# Altium schematic sheet medusa-charger.SchDoc
size Legal; SheetNumber: 5; SheetTotal: 5
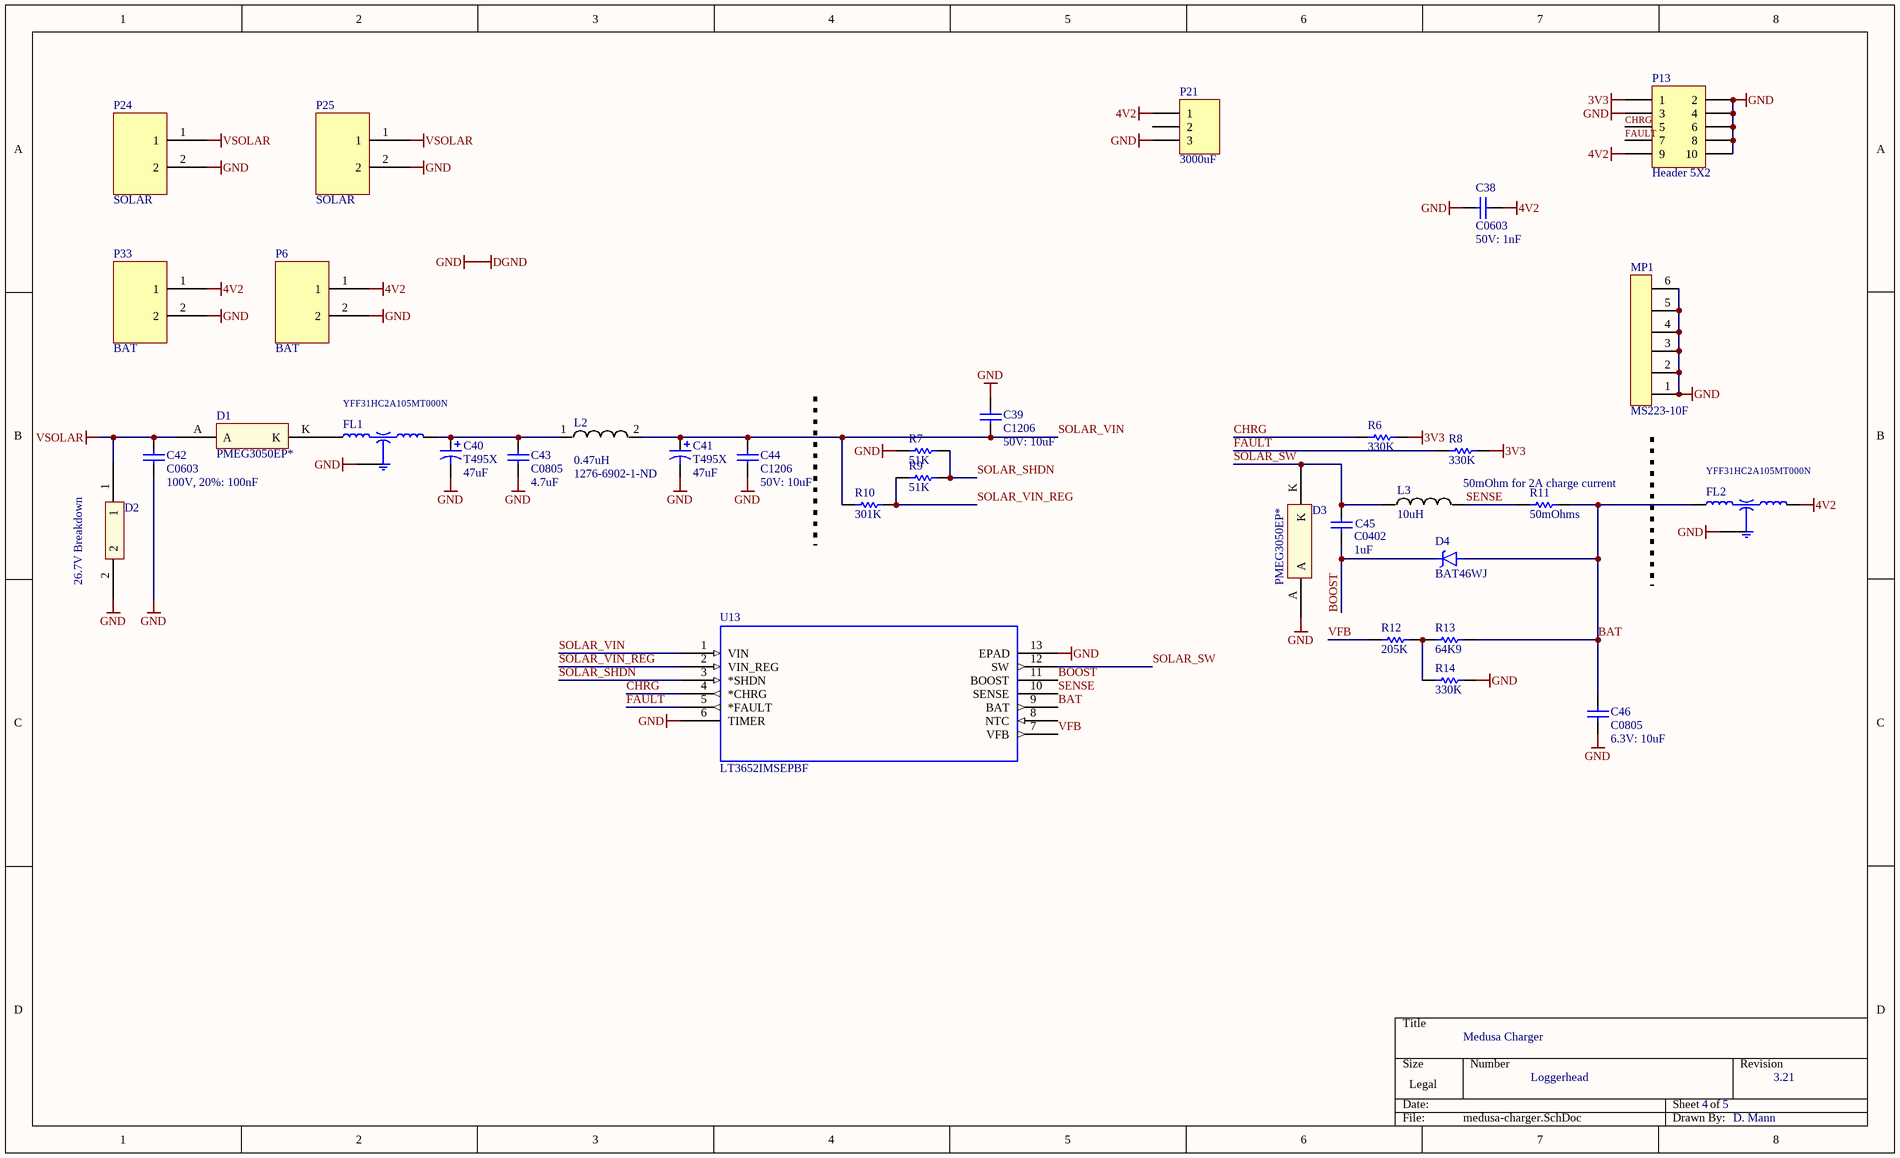
[diagram p0: medusa-charger.SchDoc]

## Parts
C38  C0603  50V: 1nF  [0603]
C39  C1206  50V: 10uF  [1206]
C40  T495X  value 47uF  [X]
C41  T495X  value 47uF  [X]
C42  C0603  100V, 20%: 100nF  [0603]
C43  C0805  value 4.7uF  [0805]
C44  C1206  50V: 10uF  [1206]
C45  C0402  value 1uF  [0402]
C46  C0805  6.3V: 10uF  [0805]
D1  PMEG3050EP*  [Diode_PMEG3050EP]
D2  26.7V Breakdown  [SMBJ24CA]
D3  PMEG3050EP*  [Diode_PMEG3050EP]
D4  BAT46WJ  [SOD-323]
FL1  YFF31HC2A105MT000N  [FIL_YFF31HC2A105MT000N]
FL2  YFF31HC2A105MT000N  [FIL_YFF31HC2A105MT000N]
L2  value 0.47uH  Supplier Part Number 1: 1276-6902-1-ND  [Inductor2016]  (hidden comment: Inductor2016)
L3  10uH  [Inductor0630CDMCD]
MP1  MS223-10F  [MS223-10F]
P6  BAT  [HDR_2x1_2mm]
P13  Header 5X2  [HDR2X5]
P21  3000uF  [HDR1X3]
P24  SOLAR  [HDR_2x1_2mm]
P25  SOLAR  [HDR_2x1_2mm]
P33  BAT  [HDR_2x1_2mm]
R6  330K  [3-0603]
R7  51K  [3-0603]
R8  330K  [3-0603]
R9  51K  [3-0603]
R10  301K  [3-0603]
R11  50mOhms  [8-1206]
R12  205K  [3-0603]
R13  64K9  [3-0603]
R14  330K  [3-0603]
U13  LT3652IMSEPBF  [MSOP-12_MSE]

## Nets
3V3: P13.1 R6.1 R8.1
4V2: C38.2 FL2.3(OUT/IN) P6.1 P13.9 P21.1 P33.1
DGND: C38.1 C39.1 C40.2 C41.2 C42.1 C43.1 C44.1 C46.1 D2.2 D3.A FL1.2_4(GND) FL2.2_4(GND) MP1.1 MP1.2 MP1.3 MP1.4 MP1.5 MP1.6 P6.2 P13.2 P13.3 P13.4 P13.6 P13.8 P13.10 P21.3 P24.2 P25.2 P33.2 R7.1 R14.1 U13.6(TIMER) U13.13(EPAD)  [also labelled GND]
VSOLAR: C42.2 D1.A D2.1 P24.1 P25.1
BAT: C46.2 D4.A FL2.1(IN/OUT) R11.2 R13.1 U13.9(BAT)
BOOST: C45.1 D4.C U13.11(BOOST)
CHRG: P13.5 R6.2 U13.4(*CHRG)
FAULT: P13.7 R8.2 U13.5(*FAULT)
SENSE: L3.2 R11.1 U13.10(SENSE)
SOLAR_SHDN: R7.2 R9.2 U13.3(*SHDN)
SOLAR_SW: C45.2 D3.K L3.1 U13.12(SW)
SOLAR_VIN: C39.2 C41.1 C44.2 L2.2 R10.1 U13.1(VIN)
SOLAR_VIN_REG: R9.1 R10.2 U13.2(VIN_REG)
VFB: R12.2 U13.7(VFB)
NetC40_1: C40.1 C43.2 FL1.3(OUT/IN) L2.1
NetD1_K: D1.K FL1.1(IN/OUT)
NetR12_1: R12.1 R13.2 R14.2

Not connected (* = marked no-connect by the designer): P21 2; U13 8(NTC)

## Notes on the sheet
- 50mOhm for 2A charge current
- Medusa Charger
- Loggerhead
- 4
- 5
- 3.21
- D. Mann

## Library data of the parts
C38 = C0603: Ceramic Chip Capacitor - Standard; Note: Footprint corresponds to dimensions for bulk cassette packaging. This case size has tightened tolerances.; Published: 17-Jul-2002; LatestRevisionDate: 19-Mar-2004; LatestRevisionNote: Silkscreen size reduced.; DatasheetDocument: Mar-2001; PackageDocument: Mar-2001; PackageReference: 0603; Publisher: Altium Limited; Code_JEITA: 0603; Code_IPC: 1608 [0603]; ComponentLink1Description: Manufacturer Link; ComponentLink1URL: http://www.kemet.com/; ComponentLink2Description: Datasheet; ComponentLink2URL: http://www.kemet.com/kemet/web/homepage/kechome.nsf/vapubfilesname/F3102TA.pdf/$file/F3102TA.pdf
C39 C44 = C1206: Ceramic Chip Capacitor - Standard; Published: 17-Jul-2002; LatestRevisionDate: 19-Mar-2004; LatestRevisionNote: Silkscreen size reduced.; DatasheetDocument: Mar-2001; PackageDocument: Mar-2001; PackageReference: 1206; Publisher: Altium Limited; Code_JEITA: 1206; Code_IPC: 3216 [1206]; ComponentLink1Description: Manufacturer Link; ComponentLink1URL: http://www.kemet.com/; ComponentLink2Description: Datasheet; ComponentLink2URL: http://www.kemet.com/kemet/web/homepage/kechome.nsf/vapubfilesname/F3102TA.pdf/$file/F3102TA.pdf
C40 C41 = T495X: Solid Tantalum Chip Capacitor, Standard T495 Series - 35V 10%; PCB_Layout: Round Glue Pad at 2.9 ±0.1mm in diameter at KEMET's option; Published: 17-Jul-2002; LatestRevisionDate: 19-Mar-2004; LatestRevisionNote: Silkscreen dimensions re-sized.; DatasheetDocument: Mar-2001; PackageDocument: Mar-2001; PackageReference: X; Publisher: Altium Limited; Code_JEITA: 7343-43; ComponentLink1Description: Manufacturer Link; ComponentLink1URL: http://www.kemet.com/; ComponentLink2Description: Datasheet; ComponentLink2URL: http://www.kemet.com/kemet/web/homepage/kechome.nsf/vapubfilesname/F3102TA.pdf/$file/F3102TA.pdf
C42 = C0603: 100V 20%; Note: Footprint corresponds to dimensions for bulk cassette packaging. This case size has tightened tolerances.; Published: 17-Jul-2002; LatestRevisionDate: 19-Mar-2004; LatestRevisionNote: Silkscreen size reduced.; DatasheetDocument: Mar-2001; PackageDocument: Mar-2001; PackageReference: 0603; Publisher: Altium Limited; Code_JEITA: 0603; Code_IPC: 1608 [0603]; ComponentLink1Description: Manufacturer Link; ComponentLink1URL: http://www.kemet.com/; ComponentLink2Description: Datasheet; ComponentLink2URL: http://www.kemet.com/kemet/web/homepage/kechome.nsf/vapubfilesname/F3102TA.pdf/$file/F3102TA.pdf
C43 C46 = C0805: Ceramic Chip Capacitor - Standard; Note: Footprint corresponds to dimensions for bulk cassette packaging. This case size has tightened tolerances.; Published: 17-Jul-2002; LatestRevisionDate: 19-Mar-2004; LatestRevisionNote: Silkscreen size reduced.; DatasheetDocument: Mar-2001; PackageDocument: Mar-2001; PackageReference: 0805; Publisher: Altium Limited; Code_JEITA: 0805; Code_IPC: 2012[0805]; ComponentLink1Description: Manufacturer Link; ComponentLink1URL: http://www.kemet.com/; ComponentLink2Description: Datasheet; ComponentLink2URL: http://www.kemet.com/kemet/web/homepage/kechome.nsf/vapubfilesname/F3102TA.pdf/$file/F3102TA.pdf
C45 = C0402: Ceramic Chip Capacitor - Standard; Note: Footprint corresponds to dimensions for bulk cassette packaging. This case size has tightened tolerances.; Published: 17-Jul-2002; LatestRevisionDate: 19-Mar-2004; LatestRevisionNote: Silkscreen size reduced.; DatasheetDocument: Mar-2001; PackageDocument: Mar-2001; PackageReference: 0402; Publisher: Altium Limited; Code_JEITA: 0402; Code_IPC: 1005 [0402]; ComponentLink1Description: Manufacturer Link; ComponentLink1URL: http://www.kemet.com/; ComponentLink2Description: Datasheet; ComponentLink2URL: http://www.kemet.com/kemet/web/homepage/kechome.nsf/vapubfilesname/F3102TA.pdf/$file/F3102TA.pdf
D1 D3 = Diode_PMEG3050EP
D2 = SMBJ24CA
D4 = BAT46WJ: Diode Schottky 100V 250mA (DC) Surface Mount SOD-323F; MF: NXP Semiconductors; SnapEDA_Link: https://www.snapeda.com/parts/BAT46WJ/NXP%20Semiconductors/view-part/4222338/?ref=snap; Package: SOD-323 NXP Semiconductors; Availability: Bad; Price: None; MP: BAT46WJ; Value: *
FL1 FL2 = YFF31HC2A105MT000N: 1ÂµF Feed Through Capacitor 100V 6A 5mOhm 1206 (3216 Metric), 4 PC Pad; MF: TDK; Value: *; Availability: Good; Price: None; SnapEDA_Link: https://www.snapeda.com/parts/YFF31HC2A105MT000N/TDK-Lambda%20Americas%20Inc/view-part/566443/?ref=snap; Check_prices: https://www.snapeda.com/parts/YFF31HC2A105MT000N/TDK-Lambda%20Americas%20Inc/view-part/566443/?ref=eda; Purchase-URL: https://pricing.snapeda.com/search/part/YFF31HC2A105MT000N/?ref=eda; Package: 1206 TDK; MP: YFF31HC2A105MT000N
L3 = Inductor_0630CDMCD
MP1 = MS223-10F: RF Shield
P6 P24 P25 P33 = HDR_2x1_2mm
P13 = Header 5X2: Header, 5-Pin, Dual row; LatestRevisionDate: 17-Jul-2002; LatestRevisionNote: Re-released for DXP Platform.; Publisher: Altium Limited
P21 = Header 3: Header, 3-Pin; LatestRevisionDate: 17-Jul-2002; LatestRevisionNote: Re-released for DXP Platform.; Publisher: Altium Limited
R6-R10 R12-R14 = ERJ3EK: Precision Thick Film Chip Resistor, 10 Ohm to 1M Ohm Range, 1% and 0.5% Tolerance, 0603 Size, 0.063 W; Published: 17-Dec-2003; LatestRevisionDate: 19-Mar-2004; LatestRevisionNote: Silkscreen size reduced.; PackageDocument: Mar-2003; PackageReference: 3-0603; Publisher: Altium Limited; Code_IPC: 1608 [0603]; ComponentLink1Description: Manufacturer Link; ComponentLink1URL: http://www.panasonic.com/industrial/components/resistive_products.htm; ComponentLink2Description: Datasheet; ComponentLink2URL: http://www.panasonic.com/industrial/components/pdf/AOA0000CE2.pdf
R11 = ERJ8EN: Precision Thick Film Chip Resistor, 10 Ohm to 2.2M Ohm Range, 1% Tolerance, 1206 Size, 0.125 W; Published: 17-Dec-2003; LatestRevisionDate: 19-Mar-2004; LatestRevisionNote: Silkscreen size reduced.; PackageDocument: Mar-2003; PackageReference: 8-1206; Publisher: Altium Limited; Code_IPC: 3216 [1206]; ComponentLink1Description: Manufacturer Link; ComponentLink1URL: http://www.panasonic.com/industrial/components/resistive_products.htm; ComponentLink2Description: Datasheet; ComponentLink2URL: http://www.panasonic.com/industrial/components/pdf/AOA0000CE2.pdf
U13 = LT3652IMSEPBF: Battery Charger Li-Ion 2000mA 4.2V Automotive 12-Pin MSOP EP Tube; MP: LT3652IMSE#PBF; MF: Analog Devices; Package: MSOP W/ EP-12 Analog Devices; Digi-Key_Purchase_URL: https://www.digikey.com/product-detail/en/linear-technology-analog-devices/LT3652IMSE-PBF/LT3652IMSE-PBF-ND/2237473?utm_source=snapeda&utm_medium=aggregator&utm_campaign=symbol; Value: *; Digi-Key_Part_Number: LT3652IMSE#PBF-ND; SnapEDA_Link: https://www.snapeda.com/parts/LT3652IMSE%23PBF/Analog%20Devices/view-part/4331669/?ref=snap
L2 = Inductor2016: Supplier 1: Digi-Key